# EAGLE design Main Board (EAGLE 9.6.2)
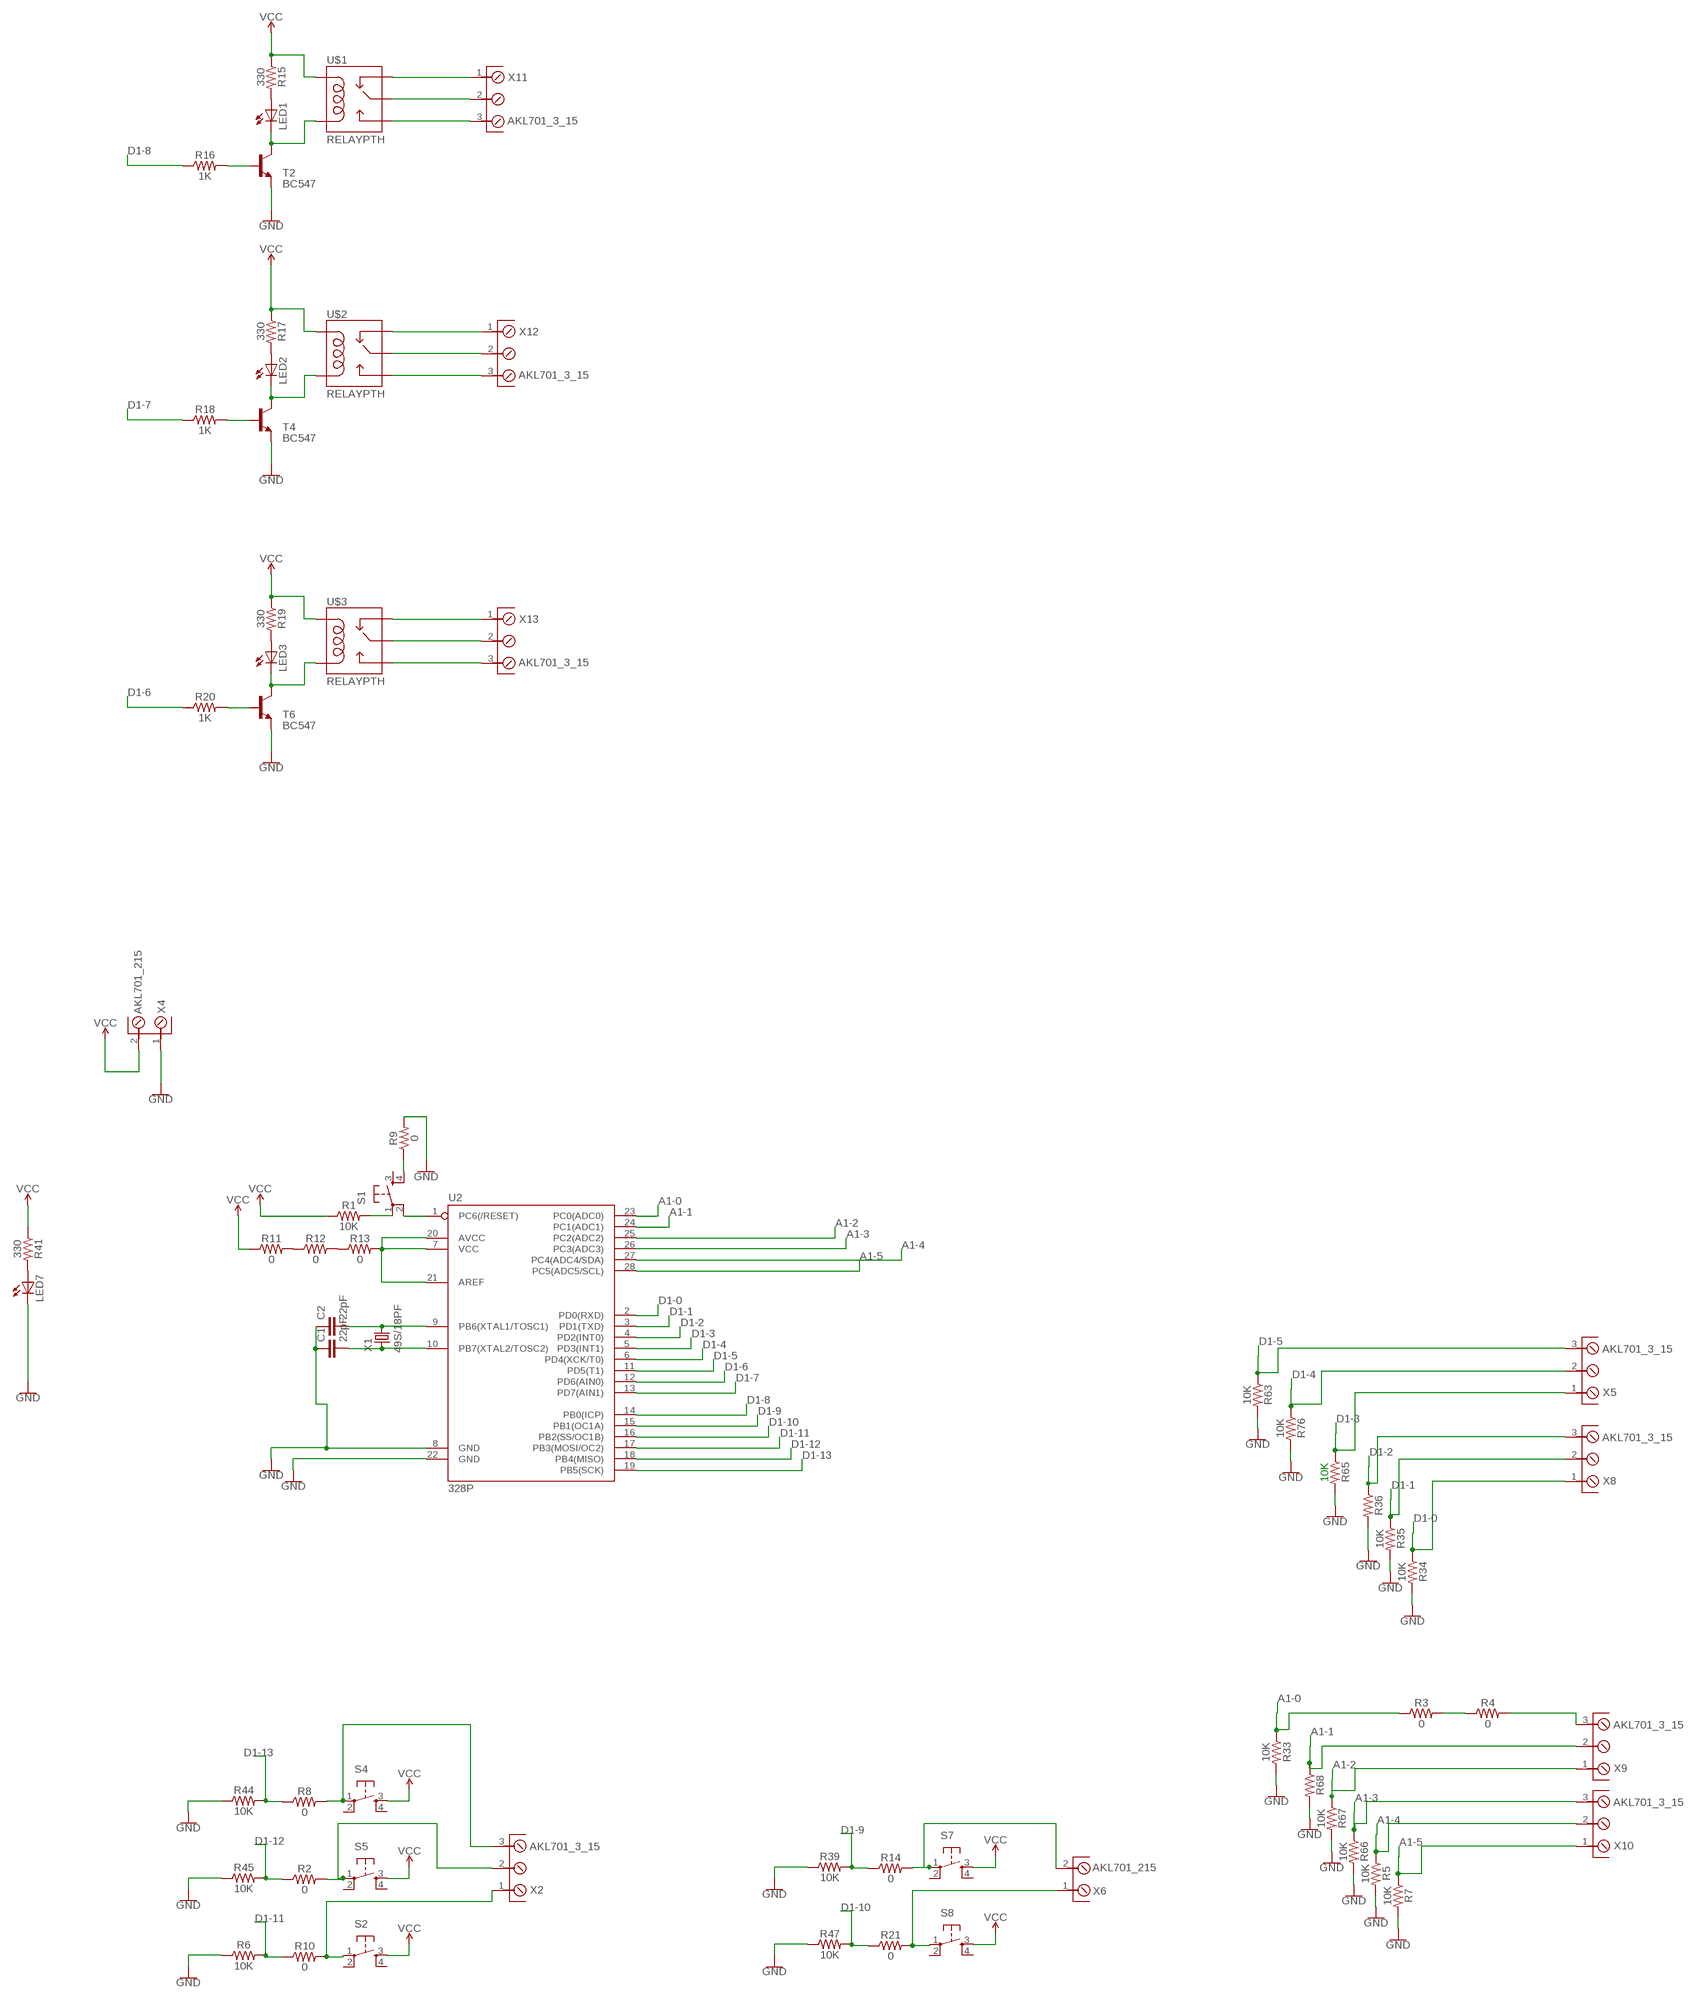
[diagram p0: schematic, sheet 1]

## Parts
C1  22pF  22PF-PTH-2.54MM-200V-5%  [CAP-PTH-2.54]
C2  22pF  22PF-PTH-2.54MM-200V-5%  [CAP-PTH-2.54]
LED1  LED5MM  [LED5MM]
LED2  LED5MM  [LED5MM]
LED3  LED5MM  [LED5MM]
LED7  LED5MM  [LED5MM]
R1  10K  10MOHM-HORIZ-1/4W-5%  [AXIAL-0.3]
R2  0  10MOHM-HORIZ-1/4W-5%  [AXIAL-0.3]
R3  0  10MOHM-HORIZ-1/4W-5%  [AXIAL-0.3]
R4  0  10MOHM-HORIZ-1/4W-5%  [AXIAL-0.3]
R5  10K  10MOHM-HORIZ-1/4W-5%  [AXIAL-0.3]
R6  10K  10MOHM-HORIZ-1/4W-5%  [AXIAL-0.3]
R7  10K  10MOHM-HORIZ-1/4W-5%  [AXIAL-0.3]
R8  0  10MOHM-HORIZ-1/4W-5%  [AXIAL-0.3]
R9  0  10MOHM-HORIZ-1/4W-5%  [AXIAL-0.3]
R10  0  10MOHM-HORIZ-1/4W-5%  [AXIAL-0.3]
R11  0  10MOHM-HORIZ-1/4W-5%  [AXIAL-0.3]
R12  0  10MOHM-HORIZ-1/4W-5%  [AXIAL-0.3]
R13  0  10MOHM-HORIZ-1/4W-5%  [AXIAL-0.3]
R14  0  10MOHM-HORIZ-1/4W-5%  [AXIAL-0.3]
R15  330  10MOHM-HORIZ-1/4W-5%  [AXIAL-0.3]
R16  1K  10MOHM-HORIZ-1/4W-5%  [AXIAL-0.3]
R17  330  10MOHM-HORIZ-1/4W-5%  [AXIAL-0.3]
R18  1K  10MOHM-HORIZ-1/4W-5%  [AXIAL-0.3]
R19  330  10MOHM-HORIZ-1/4W-5%  [AXIAL-0.3]
R20  1K  10MOHM-HORIZ-1/4W-5%  [AXIAL-0.3]
R21  0  10MOHM-HORIZ-1/4W-5%  [AXIAL-0.3]
R33  10K  10MOHM-HORIZ-1/4W-5%  [AXIAL-0.3]
R34  10K  10MOHM-HORIZ-1/4W-5%  [AXIAL-0.3]
R35  10K  10MOHM-HORIZ-1/4W-5%  [AXIAL-0.3]
R36  10K  10MOHM-HORIZ-1/4W-5%  [AXIAL-0.3]
R39  10K  10MOHM-HORIZ-1/4W-5%  [AXIAL-0.3]
R41  330  10MOHM-HORIZ-1/4W-5%  [AXIAL-0.3]
R44  10K  10MOHM-HORIZ-1/4W-5%  [AXIAL-0.3]
R45  10K  10MOHM-HORIZ-1/4W-5%  [AXIAL-0.3]
R47  10K  10MOHM-HORIZ-1/4W-5%  [AXIAL-0.3]
R63  10K  10MOHM-HORIZ-1/4W-5%  [AXIAL-0.3]
R65  10K  10MOHM-HORIZ-1/4W-5%  [AXIAL-0.3]
R66  10K  10MOHM-HORIZ-1/4W-5%  [AXIAL-0.3]
R67  10K  10MOHM-HORIZ-1/4W-5%  [AXIAL-0.3]
R68  10K  10MOHM-HORIZ-1/4W-5%  [AXIAL-0.3]
R76  10K  10MOHM-HORIZ-1/4W-5%  [AXIAL-0.3]
S1  TAC_SWITCHPTH  [TACTILE-PTH]
S2  TAC_SWITCHPTH  [TACTILE-PTH]
S4  TAC_SWITCHPTH  [TACTILE-PTH]
S5  TAC_SWITCHPTH  [TACTILE-PTH]
S7  TAC_SWITCHPTH  [TACTILE-PTH]
S8  TAC_SWITCHPTH  [TACTILE-PTH]
T2  BC547  [TO92]
T4  BC547  [TO92]
T6  BC547  [TO92]
U2  328P  ATMEGA328P_PDIP  [DIP28]
U$1  RELAYPTH  [SRD-05VDC-SL-C]
U$2  RELAYPTH  [SRD-05VDC-SL-C]
U$3  RELAYPTH  [SRD-05VDC-SL-C]
X1  49S/18PF  [XTAL_HC49]
X2  AKL701_3_15  [AKL701_3_15]
X4  AKL701_215  [AKL701_2_15]
X5  AKL701_3_15  [AKL701_3_15]
X6  AKL701_215  [AKL701_2_15]
X8  AKL701_3_15  [AKL701_3_15]
X9  AKL701_3_15  [AKL701_3_15]
X10  AKL701_3_15  [AKL701_3_15]
X11  AKL701_3_15  [AKL701_3_15]
X12  AKL701_3_15  [AKL701_3_15]
X13  AKL701_3_15  [AKL701_3_15]

## Nets
A1-0: R3.P$1 R33.P$1 U2.23(PC0(ADC0))
A1-1: R68.P$1 U2.24(PC1(ADC1)) X9.2
A1-2: R67.P$1 U2.25(PC2(ADC2)) X9.1
A1-3: R66.P$1 U2.26(PC3(ADC3)) X10.3
A1-4: R5.P$1 U2.27(PC4(ADC4/SDA)) X10.2
A1-5: R7.P$1 U2.28(PC5(ADC5/SCL)) X10.1
D1-0: R34.P$1 U2.2(PD0(RXD)) X8.1
D1-1: R35.P$1 U2.3(PD1(TXD)) X8.2
D1-2: R36.P$1 U2.4(PD2(INT0)) X8.3
D1-3: R65.P$1 U2.5(PD3(INT1)) X5.1
D1-4: R76.P$1 U2.6(PD4(XCK/T0)) X5.2
D1-5: R63.P$1 U2.11(PD5(T1)) X5.3
D1-6: R20.P$1 U2.12(PD6(AIN0))
D1-7: R18.P$1 U2.13(PD7(AIN1))
D1-8: R16.P$1 U2.14(PB0(ICP))
D1-9: R14.P$1 R39.P$2 U2.15(PB1(OC1A))
D1-10: R21.P$1 R47.P$2 U2.16(PB2(SS/OC1B))
D1-11: R6.P$2 R10.P$1 U2.17(PB3(MOSI/OC2))
D1-12: R2.P$1 R45.P$2 U2.18(PB4(MISO))
D1-13: R8.P$1 R44.P$2 U2.19(PB5(SCK))
GND: C1.1 C2.1 LED7.K(C) R5.P$2 R6.P$1 R7.P$2 R9.P$2 R33.P$2 R34.P$2 R35.P$2 R36.P$2 R39.P$1 R44.P$1 R45.P$1 R47.P$1 R63.P$2 R65.P$2 R66.P$2 R67.P$2 R68.P$2 R76.P$2 T2.1(E) T4.1(E) T6.1(E) U2.8(GND) U2.22(GND) X4.1
N$1: C2.2 U2.9(PB6(XTAL1/TOSC1)) X1.2
N$2: C1.2 U2.10(PB7(XTAL2/TOSC2)) X1.1
N$3: R1.P$2 S1.1
N$4: S1.2 U2.1(PC6(/RESET))
N$5: U$3.SWCLOSED(SWCLOSE) X13.1
N$6: U$3.SWCOMMON X13.2
N$7: U$3.SWOPEN X13.3
N$8: U$2.SWCLOSED(SWCLOSE) X12.1
N$9: LED1.A R15.P$2
N$10: LED1.K(C) T2.3(C) U$1.COIL0
N$11: R16.P$2 T2.2(B)
N$12: U$2.SWCOMMON X12.2
N$13: U$2.SWOPEN X12.3
N$14: U$1.SWCLOSED(SWCLOSE) X11.1
N$15: LED2.A R17.P$2
N$16: LED2.K(C) T4.3(C) U$2.COIL0
N$17: R18.P$2 T4.2(B)
N$18: U$1.SWCOMMON X11.2
N$19: U$1.SWOPEN X11.3
N$20: R10.P$2 S2.1 X2.1
N$21: LED3.A R19.P$2
N$22: LED3.K(C) T6.3(C) U$3.COIL0
N$23: R20.P$2 T6.2(B)
N$24: R2.P$2 S5.1 X2.2
N$25: R4.P$2 X9.3
N$26: R3.P$2 R4.P$1
N$27: R8.P$2 S4.1 X2.3
N$28: R14.P$2 S7.1 X6.2
N$29: R21.P$2 S8.1 X6.1
N$46: LED7.A R41.P$2
N$55: R9.P$1 S1.4
N$58: R13.P$2 U2.7(VCC) U2.20(AVCC) U2.21(AREF)
N$59: R11.P$2 R12.P$1
N$60: R12.P$2 R13.P$1
VCC: R1.P$1 R11.P$1 R15.P$1 R17.P$1 R19.P$1 R41.P$1 S2.3 S4.3 S5.3 S7.3 S8.3 U$1.COIL1 U$2.COIL1 U$3.COIL1 X4.2
Unconnected: S1.3 S2.2 S2.4 S4.2 S4.4 S5.2 S5.4 S7.2 S7.4 S8.2 S8.4

## Library data of the parts
C1 C2 = SparkFun-Capacitors:22PF: 22pF ceramic capacitors A capacitor is a passive two-terminal electrical component used to store electrical energy temporarily in an electric field.; PROD_ID: CAP-09128
LED1-LED3 LED7 = adafruit:LED: LED OSRAM: - CHIPLED LG R971, LG N971, LY N971, LG Q971, LY Q971, LO R971, LY R971 LH N974, LH R974 LS Q976, LO Q976, LY Q976 LO Q996 - Hyper CHIPLED LW Q18S LB Q993, LB Q99A, LB R99A - SideLED LS A670, LO A670, LY A670, LG A670, LP A670 LB A673, LV A673, LT A673, LW A673 LH A674 LY A675 LS A676, LA A676, LO A676, LY A676, LW A676 LS A679, LY A679, LG A679 - Hyper Micro SIDELED® LS Y876, LA Y876, LO Y876, LY Y876 LT Y87S - SmartLED LW L88C, LW L88S LB L89C, LB L89S, LG L890 LS L89K, LO L89K, LY L89K LS L896, LA L896, LO L896, LY L896 - TOPLED LS T670, LO T670, LY T670, LG T670, LP T670 LSG T670, LSP T670, LSY T670, LOP T670, LYG T670 LG T671, LOG T671, LSG T671 LB T673, LV T673, LT T673, LW T673 LH T674 LS T676, LA T676, LO T676, LY T676, LB T676, LH T676, LSB T676, LW T676 LB T67C, LV T67C, LT T67C, LS T67K, LO T67K, LY T67K, LW E67C LS E67B, LA E67B, LO E67B, LY E67B, LB E67C, LV E67C, LT E67C LW T67C LS T679, LY T679, LG T679 LS T770, LO T770, LY T770, LG T770, LP T770 LB T773, LV T773, LT T773, LW T773 LH T774 LS E675, LA E675, LY E675, LS T675 LS T776, LA T776, LO T776, LY T776, LB T776 LHGB T686 LT T68C, LB T68C - Hyper Mini TOPLED® LB M676 - Mini TOPLED Santana® LG M470 LS M47K, LO M47K, LY M47K Source: http://www.osram.convergy.de/
R1-R21 R33-R36 R39 R41 R44 R45 R47 R63 R65-R68 R76 = SparkFun-Resistors:10MOHM: RES-09327; PROD_ID: RES-09327; VALUE: 10M
S1 S2 S4 S5 S7 S8 = SparkFun:TAC_SWITCH: Momentary Switch Button commonly used for reset or general input. Spark Fun Electronics SKU : COM-00097
T2 T4 T6 = transistor:BC547: NPN TRANSISTOR
U2 = SparkFun-IC-Microcontroller:ATMEGA328P_PDIP: Atmel 328P Through hole ATMEGA328P uC used in the Arduino 32kb flash, 1k EEPROM, 2k SRAM Datasheet <http://www.sparkfun.com/datasheets/Components/SMD/ATMega328.pdf> SparkFun Products Storefront component: AVR 28 Pin 20MHz 32K 6A/D - ATMega328P <https://www.sparkfun.com/products/9061> (COM-09061) SparkFun Simon Says - Through-Hole Soldering Kit <https://www.sparkfun.com/products/10547> (KIT-10547) SparkFun Learn to Solder - Simon Says <https://www.sparkfun.com/products/13708> (KIT-13708) SparkFun BigTime Watch Kit <https://www.sparkfun.com/products/11734> (KIT-11734) SparkFun ClockIt <https://www.sparkfun.com/products/10930> (KIT-10930) SparkFun Serial Enabled LCD Kit <https://www.sparkfun.com/products/10097> (LCD-10097) SparkFun Simon Tilts - Through Hole Soldering Kit <https://www.sparkfun.com/products/12634> (KIT-12634) SparkFun Frequency Counter Kit <https://www.sparkfun.com/products/10140> (KIT-10140) FabFM Radio Kit <https://www.sparkfun.com/products/11043> (KIT-11043) SparkFun Binary Blaster Kit <https://www.sparkfun.com/products/12037> (KIT-12037) SparkFun Metro-Gnome <https://www.sparkfun.com/products/9236> (KIT-09236) ATmega328 with Arduino Optiboot (Uno) <https://www.sparkfun.com/products/10524> (DEV-10524); PROD_ID: IC-09136
U$1-U$3 = SRD-05VDC-SL-C:RELAY: SPDT relay (COM-00101)
X1 = Crystals_Oscillators:49S/18PF: Crystal Manufacturer's datasheet <https://datasheet.octopart.com/49S-18PF-Xinhunjing-datasheet-30677139.pdf>; CREATED_BY: PCBLayout.com; MANUFACTURER: Xinhunjing; MPN: 49S/18PF; PACKAGE: SMD
X2 X5 X8-X13 = _con_riacon_akl701:AKL701_3*: RIACON (Ria Connect) Screw Type Terminal Block Type AKL 701 - 3 (pole-size: 3) centerline 6.35 mm / 0.250 inches, 400 V / 24 A, horizontal wire entry, lift system, modular packages: _13: recommended pcb hole dia. = 1,3 mm _15: pcb hole dia. = 1,5 mm (prototyping) Auhtor: Dipl.-Ing. FH Rainer Bayer, Hochschule Heilbronn (rainer.bayer@hs-heilbronn.de)
X4 X6 = _con_riacon_akl701:AKL701_2*: RIACON (Ria Connect) Screw Type Terminal Block Type AKL 701 - 2 (pole-size: 2) centerline 6.35 mm / 0.250 inches, 400 V / 24 A, horizontal wire entry, lift system, modular packages: _13: recommended pcb hole dia. = 1,3 mm _15: pcb hole dia. = 1,5 mm (prototyping) Auhtor: Dipl.-Ing. FH Rainer Bayer, Hochschule Heilbronn (rainer.bayer@hs-heilbronn.de)

## Board
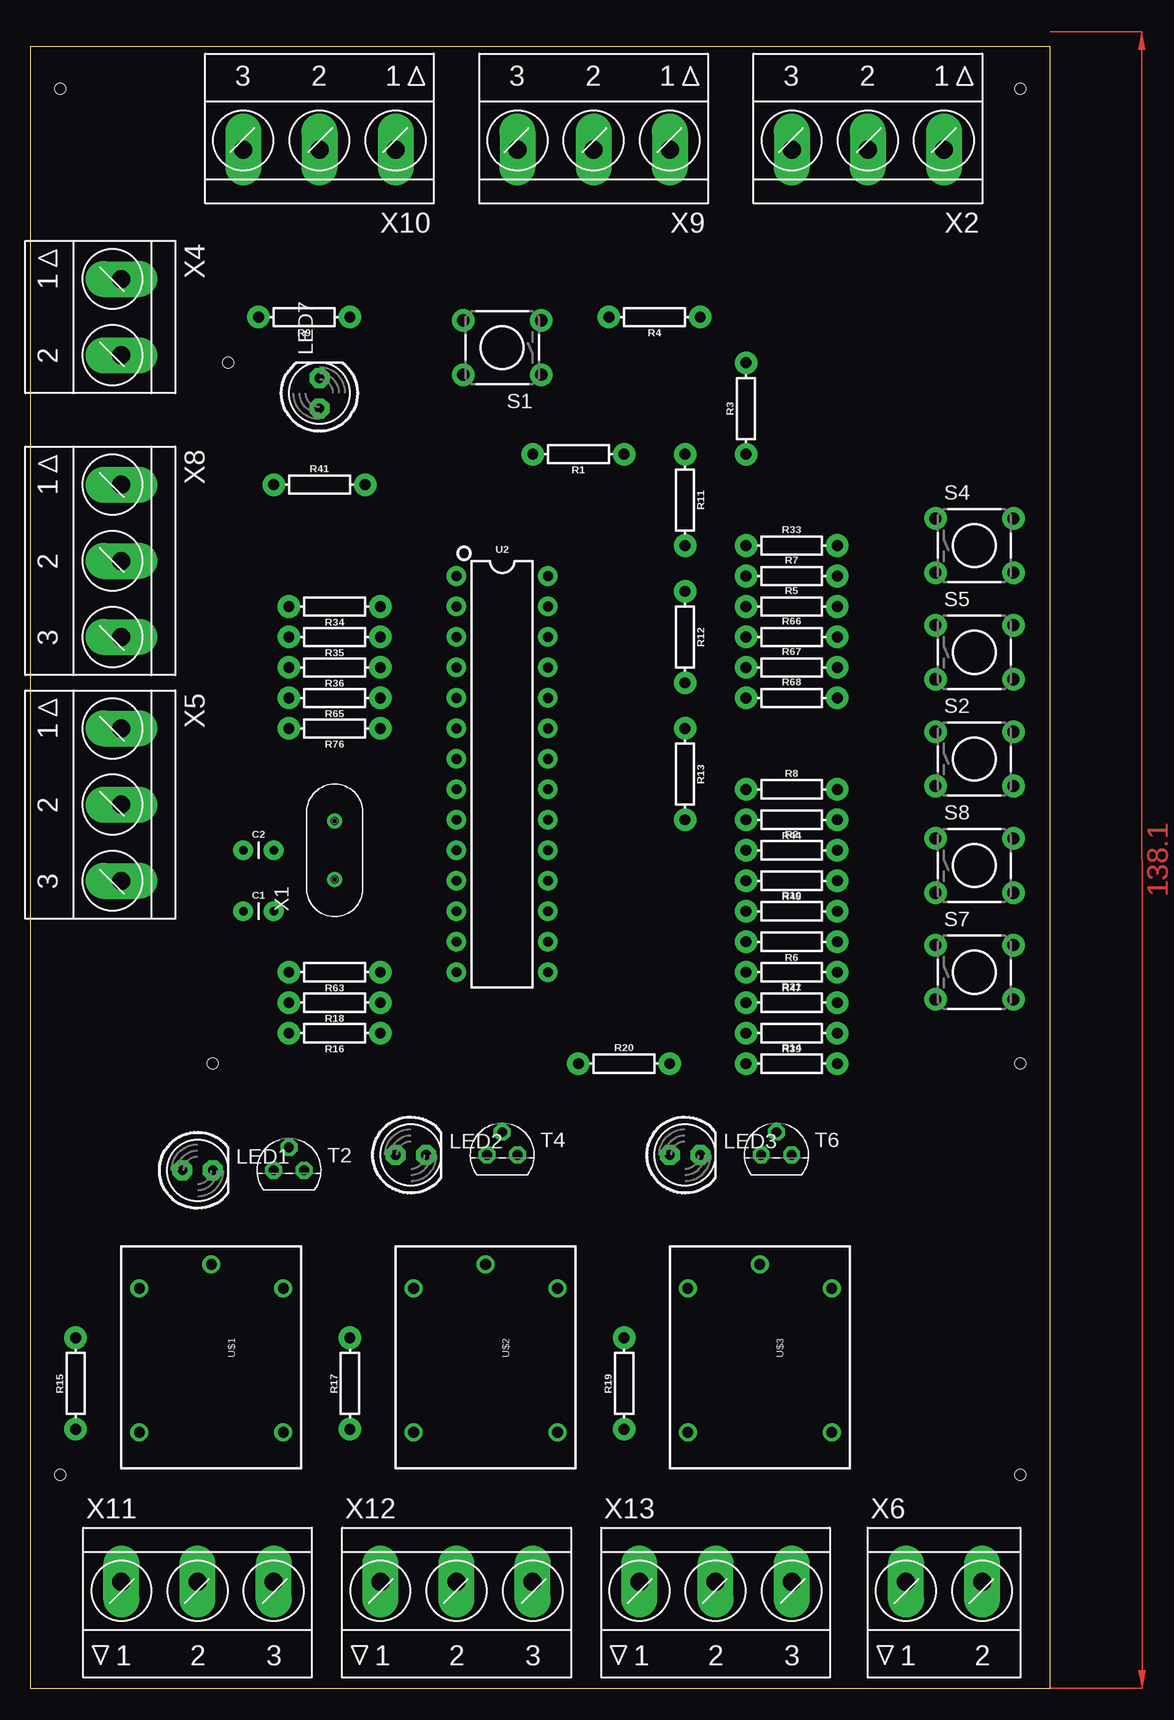
[diagram p1: board, top side]
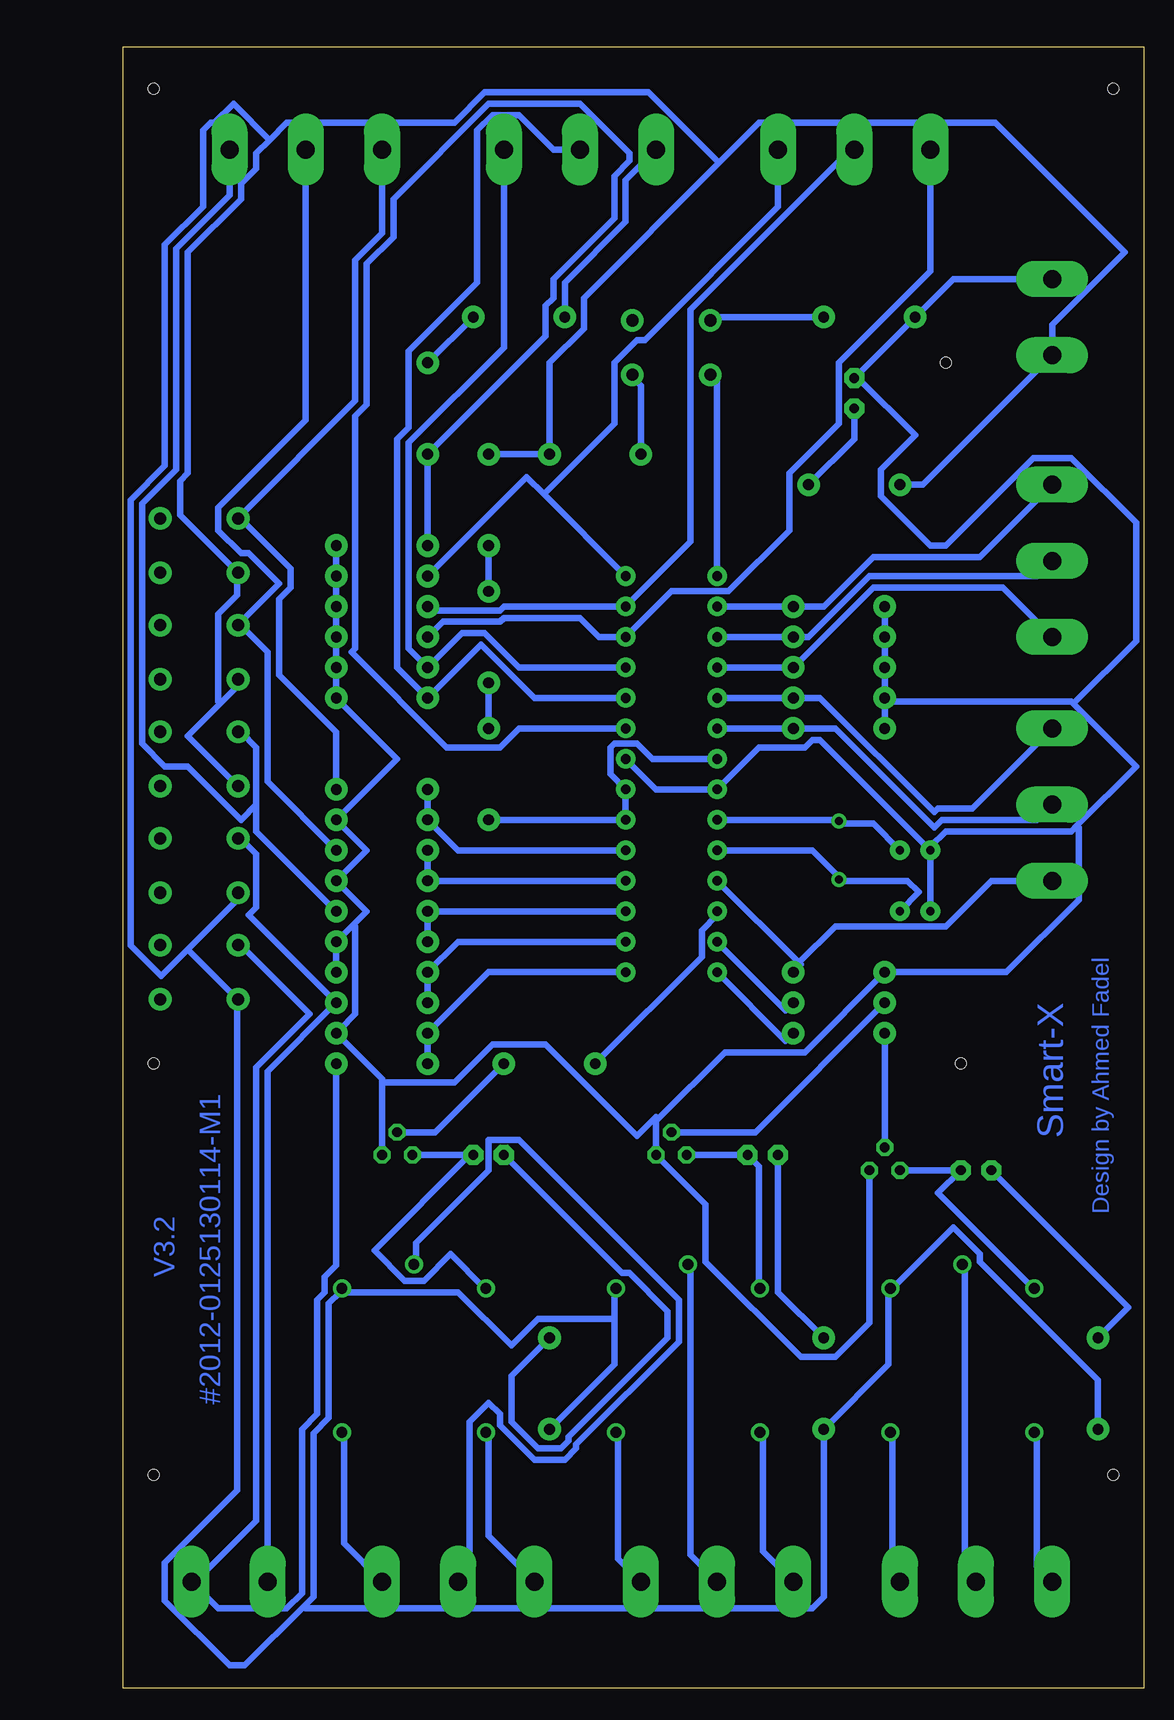
[diagram p2: board, bottom side, seen from below]

Size 85.07 x 136.83 mm. Coordinates in mm from the lower left corner, seen from the top.
Outline: 0,0 85.07,0 85.07,136.83 0,136.83 0,0
Copper layers 16: Bottom 0.035mm
Design rules "eC_1Layer_PClass6_BaseCopperO35_eCDefault *": minimum track width 0.53mm, minimum drill 0.35mm, track to track 0.15mm, track to pad 0.15mm, pad to pad 0.15mm, via to via 0.15mm, smd to smd 0mil, copper to edge 0.25mm, drill to drill 0.35mm, minimum pad ring 0.3mm, minimum via ring 0.3mm, stop-mask expansion 0mil, vias tented up to drill 0.45mm, thermal gap 0.2mm
Holes 0.9 mm at 2.54,133.35 82.55,133.35 82.55,52.07 15.24,52.07 2.54,17.78 82.55,17.78 16.51,110.49

### Footprints (pad centres in the part's own frame; a part is rotated, then mirrored left to right if it is on the bottom)
CAP-PTH-2.54 = drill 0.7 pad 1.651: 1 -1.27,0; 2 1.27,0
LED5MM = drill 0.813 pad 1.676 octagon: A -1.27,0; K 1.27,0
AXIAL-0.3 = drill 0.9 pad 1.88: P$1 -3.81,0; P$2 3.81,0
TACTILE-PTH = drill 1.016 pad 1.88: 1 -3.251,2.261; 2 3.251,2.261; 3 -3.251,-2.261; 4 3.251,-2.261
TO92 = drill 0.813 octagon: 1 1.27,0; 2 0,1.905; 3 -1.27,0
DIP28 = drill 0.813 pad 1.626: 1 -16.51,-3.81; 2 -13.97,-3.81; 3 -11.43,-3.81; 4 -8.89,-3.81; 5 -6.35,-3.81; 6 -3.81,-3.81; 7 -1.27,-3.81; 8 1.27,-3.81; 9 3.81,-3.81; 10 6.35,-3.81; 11 8.89,-3.81; 12 11.43,-3.81; 13 13.97,-3.81; 14 16.51,-3.81; 15 16.51,3.81; 16 13.97,3.81; 17 11.43,3.81; 18 8.89,3.81; 19 6.35,3.81; 20 3.81,3.81; 21 1.27,3.81; 22 -1.27,3.81; 23 -3.81,3.81; 24 -6.35,3.81; 25 -8.89,3.81; 26 -11.43,3.81; 27 -13.97,3.81; 28 -16.51,3.81
SRD-05VDC-SL-C = drill 0.9: COIL0 -5.39,-6.12; COIL1 -5.39,5.88; SWCLOSED 6.61,-6.12; SWCOMMON -7.39,-0.12; SWOPEN 6.61,5.88
XTAL_HC49 = drill 0.65 pad 1.05: 1 -2.44,0; 2 2.44,0
AKL701_3_15 = drill 1.5 pad 3 long: 1 -6.35,0; 2 0,0; 3 6.35,0
AKL701_2_15 = drill 1.5 pad 3 long: 1 -3.175,0; 2 3.175,0

### Placement (x,y rotation side)
C1  19.05,64.77 0 top
C2  19.05,69.85 0 top
LED1  13.97,43.18 0 top
LED2  31.75,44.45 0 top
LED3  54.61,44.45 0 top
LED7  24.13,107.95 90 top
R1  45.72,102.87 180 top
R2  63.5,69.85 0 top
R3  59.69,106.68 90 top
R4  52.07,114.3 180 top
R5  63.5,90.17 0 top
R6  63.5,62.23 180 top
R7  63.5,92.71 0 top
R8  63.5,74.93 0 top
R9  22.86,114.3 180 top
R10  63.5,64.77 0 top
R11  54.61,99.06 270 top
R12  54.61,87.63 270 top
R13  54.61,76.2 270 top
R14  63.5,52.07 0 top
R15  3.81,25.4 90 top
R16  25.4,54.61 180 top
R17  26.67,25.4 90 top
R18  25.4,57.15 180 top
R19  49.53,25.4 90 top
R20  49.53,52.07 0 top
R21  63.5,57.15 0 top
R33  63.5,95.25 0 top
R34  25.4,90.17 180 top
R35  25.4,87.63 180 top
R36  25.4,85.09 180 top
R39  63.5,54.61 180 top
R41  24.13,100.33 0 top
R44  63.5,72.39 180 top
R45  63.5,67.31 180 top
R47  63.5,59.69 180 top
R63  25.4,59.69 180 top
R65  25.4,82.55 180 top
R66  63.5,87.63 0 top
R67  63.5,85.09 0 top
R68  63.5,82.55 0 top
R76  25.4,80.01 180 top
S1  39.37,111.76 180 top
S2  78.74,77.47 0 top
S4  78.74,95.25 0 top
S5  78.74,86.36 0 top
S7  78.74,59.69 0 top
S8  78.74,68.58 0 top
T2  21.59,43.18 0 top
T4  39.37,44.45 0 top
T6  62.23,44.45 0 top
U2  39.37,76.2 270 top
U$1  15.24,27.94 270 top
U$2  38.1,27.94 270 top
U$3  60.96,27.94 270 top
X1  25.4,69.85 90 top
X2  69.85,128.27 180 top
X4  7.62,114.3 270 top
X5  7.62,73.66 270 top
X6  76.2,8.89 0 top
X8  7.62,93.98 270 top
X9  46.99,128.27 180 top
X10  24.13,128.27 180 top
X11  13.97,8.89 0 top
X12  35.56,8.89 0 top
X13  57.15,8.89 0 top

### Tracks (layer width: path | path; a pad name or v marks a point on that pad's centre or on a via)
A1-0
  Bottom 0.53: U2.23 52.07,80.01 53.66,78.42 58.1,78.42 66.04,86.36 65.72,86.68 65.72,106.05 64.77,107 64.77,118.75 62.55,120.97 62.55,124.14 54.61,132.08 46.99,132.08 42.86,127.95 42.86,127.32 44.13,126.05 44.13,122.55 49.21,117.47 49.21,115.89 49.85,115.25 49.85,112.71 R3.P$1 R33.P$1
A1-1
  Bottom 0.53: U2.24 50.8,82.55 55.25,87 R68.P$1 62.23,85.09 62.23,104.14 61.28,105.09 61.28,111.44 55.56,117.16 55.56,129.86 54.29,131.13 52.07,131.13 49.21,128.27 X9.2
A1-2
  Bottom 0.53: U2.25 52.07,85.09 54.93,87.95 56.83,87.95 R67.P$1 61.28,86.68 61.28,103.82 53.34,111.76 X9.1
A1-3
  Bottom 0.53: R66.P$1 58.42,88.9 53.66,88.9 53.34,89.22 46.99,89.22 45.4,87.63 U2.26 39.37,91.44 34.61,91.44 29.53,96.52 29.53,101.28 25.4,105.41 25.4,110.49 17.78,118.11 X10.3
A1-4
  Bottom 0.53: R5.P$1 59.37,89.85 53.66,89.85 53.34,90.17 U2.27 37.78,95.57 37.78,114.94 24.45,128.27 X10.2
A1-5
  Bottom 0.53: 50.01,99.54 51.44,100.97 R7.P$1 | 50.01,99.54 U2.28 | X10.1 30.48,123.51 41.59,112.39 42.23,112.39 44.13,110.49 44.13,105.41 50.01,99.54
D1-0
  Bottom 0.53: U2.2 R34.P$1 26.67,90.17 22.54,94.3 13.65,94.3 X8.1
D1-1
  Bottom 0.53: U2.3 R35.P$1 27.94,87.63 22.86,92.71 8.89,92.71 X8.2
D1-2
  Bottom 0.53: U2.4 R36.P$1 22.54,91.76 11.75,91.76 X8.3
D1-3
  Bottom 0.53: U2.5 R65.P$1 26.99,82.55 17.46,73.03 17.14,73.34 14.29,73.34 X5.1
D1-4
  Bottom 0.53: U2.6 R76.P$1 25.72,80.01 17.46,71.75 16.83,72.39 8.89,72.39 X5.2
D1-5
  Bottom 0.53: 28.73,60.48 28.58,60.33 R63.P$1 | 28.73,60.48 U2.11 | X5.3 12.7,67.31 16.51,63.5 25.72,63.5 28.73,60.48
D1-6
  Bottom 0.53: U2.12 35.56,64.45 36.83,63.18 36.83,60.96 R20.P$1
D1-7
  Bottom 0.53: U2.13 29.84,56.52 R18.P$1
D1-8
  Bottom 0.53: U2.14 29.84,53.97 R16.P$1
D1-9
  Bottom 0.53: U2.15 54.61,59.69 R39.P$2 R14.P$1
D1-10
  Bottom 0.53: U2.16 57.15,62.23 R47.P$2 R21.P$1
D1-11
  Bottom 0.53: U2.17 R10.P$1 R6.P$2
D1-12
  Bottom 0.53: U2.18 R45.P$2 R2.P$1
D1-13
  Bottom 0.53: U2.19 57.15,69.85 R44.P$2 R8.P$1
GND
  Bottom 0.53: R33.P$2 R7.P$2 R5.P$2 R66.P$2 R67.P$2 R68.P$2 62.23,77.47 R44.P$1 64.77,69.85 R45.P$1 64.77,64.77 65.88,63.66 | 63.5,50.48 63.5,50.8 R39.P$1 66.99,54.61 66.99,54.93 65.72,56.2 65.72,63.5 65.88,63.66 | 63.5,50.48 T6.1 | R47.P$1 R6.P$1 65.88,63.66 | T2.1 22.86,30.48 25.72,27.62 28.58,27.62 36.51,35.56 36.51,40.32 T4.1 40.64,47.31 40.48,47.47 | 40.48,47.47 34.92,53.02 28.26,53.02 R63.P$2 11.43,59.69 5.4,65.72 5.4,71.75 5.56,71.91 | X4.1 15.88,117.47 R9.P$2 LED7.K 23.81,109.22 19.05,104.46 21.91,101.6 21.91,99.38 17.78,95.25 16.51,95.25 9.21,102.55 6.03,102.55 0.63,97.16 0.63,87.31 5.87,82.07 | 21.59,82.23 R76.P$2 | R34.P$2 R35.P$2 R36.P$2 R65.P$2 21.59,82.23 | C2.1 C1.1 | U2.22 40.64,74.93 U2.8 32.07,78.42 28.26,78.42 27.62,79.06 26.99,79.06 C2.1 | 21.59,82.23 6.03,82.23 5.87,82.07 | 5.87,82.07 0.63,76.84 5.56,71.91 | 5.56,71.91 6.03,71.44 16.51,71.44 17.78,70.17 C2.1 | 63.5,50.48 57.47,50.48 54.29,53.66 49.85,53.66 42.23,46.04 40.64,47.62 40.48,47.47
N$1
  Bottom 0.53: C2.2 22.54,72.07 25.4,72.07 X1.2 25.4,72.39 U2.9
N$2
  Bottom 0.53: C1.2 18.73,66.36 19.68,67.31 25.4,67.31 X1.1 25.4,67.63 27.62,69.85 U2.10
N$3
  Bottom 0.53: R1.P$2 41.91,108.58 42.55,109.22 S1.1
N$4
  Bottom 0.53: U2.1 35.56,108.9 35.88,109.22 S1.2
N$5
  Bottom 0.53: X13.1 54.61,12.7 54.61,21.27 U$3.SWCLOSED
N$6
  Bottom 0.53: X13.2 56.2,9.84 56.2,22.22 54.61,23.81 53.66,22.86 53.66,21.91 50.8,19.05 48.26,19.05 47.31,20 47.31,20.32 38.73,28.89 38.73,32.38 52.07,45.72 54.61,45.72 54.61,43.18 60.64,37.15 60.64,35.56 U$3.SWCOMMON
N$7
  Bottom 0.53: X13.3 66.67,12.06 66.67,21.27 U$3.SWOPEN
N$8
  Bottom 0.53: X12.1 31.75,11.43 31.75,21.27 U$2.SWCLOSED
N$9
  Bottom 0.53: LED1.A 1.27,31.75 R15.P$2
N$10
  Bottom 0.53: T2.3 LED1.K 17.14,41.27 9.21,33.34 U$1.COIL0
N$11
  Bottom 0.53: R16.P$2 T2.2
N$12
  Bottom 0.53: X12.2 37.78,11.11 37.78,35.24 U$2.SWCOMMON
N$13
  Bottom 0.53: X12.3 43.81,10.79 43.81,21.27 U$2.SWOPEN
N$14
  Bottom 0.53: X11.1 8.89,10.16 8.89,21.27 U$1.SWCLOSED
N$15
  Bottom 0.53: LED2.A 30.48,33.02 R17.P$2
N$16
  Bottom 0.53: T4.3 LED2.K 32.07,43.5 32.07,33.34 U$2.COIL0
N$17
  Bottom 0.53: T4.2 32.38,46.35 R18.P$2
N$18
  Bottom 0.53: X11.2 14.92,9.84 14.92,35.24 U$1.SWCOMMON
N$19
  Bottom 0.53: X11.3 20.95,9.52 20.95,21.27 U$1.SWOPEN
N$20
  Bottom 0.53: R10.P$2 73.98,71.44 73.98,73.66 | 73.98,73.66 73.98,78.42 75.25,79.69 S2.1 | X2.1 76.2,124.46 80.64,120.02 80.64,101.6 83.5,98.74 83.5,78.74 81.6,76.84 79.69,76.84 75.25,72.39 73.98,73.66
N$21
  Bottom 0.53: LED3.A 43.5,34.61 42.86,34.61 39.69,31.43 39.69,29.21 47.94,20.95 47.94,20.64 48.58,20 50.48,20 52.7,22.22 52.7,26.03 R19.P$2
N$22
  Bottom 0.53: 56.2,44.45 T6.3 | 56.2,44.45 64.14,36.51 61.59,33.97 60.01,33.97 57.78,36.2 54.93,33.34 U$3.COIL0 | 56.2,44.45 LED3.K
N$23
  Bottom 0.53: T6.2 59.05,46.35 R20.P$2
N$24
  Bottom 0.53: R2.P$2 73.03,75.56 73.03,86.36 75.25,88.58 S5.1 75.25,88.9 72.07,92.07 74.61,94.61 75.25,94.61 77.15,96.52 77.15,98.42 69.85,105.73 X2.2
N$25
  Bottom 0.53: R4.P$2 48.26,117.16 43.18,122.24 43.18,125.73 X9.3
N$26
  Bottom 0.53: R3.P$2 R4.P$1
N$27
  Bottom 0.53: R8.P$2 67.31,79.69 72.07,84.45 72.07,90.81 71.12,91.76 71.12,93.34 75.25,97.47 S4.1 75.25,97.79 65.72,107.31 65.72,119.06 63.5,121.28 X2.3
N$28
  Bottom 0.53: R14.P$2 67.31,35.24 68.26,34.29 68.26,33.02 68.9,32.38 68.9,22.86 70.17,21.59 70.17,7.94 71.44,6.67 77.15,6.67 X6.2 79.06,8.89 73.98,13.97 73.98,51.75 69.53,56.2 75.25,61.91 S7.1
N$29
  Bottom 0.53: S8.1 75.25,70.8 73.98,69.53 73.98,65.09 74.61,64.45 R21.P$2 73.03,51.44 X6.1
N$46
  Bottom 0.53: LED7.A 24.13,104.14 R41.P$2
N$55
  Bottom 0.53: R9.P$1 35.88,114.3 S1.4
N$58
  Bottom 0.53: U2.7 40.96,77.47 42.23,78.74 44.13,78.74 44.45,78.42 44.45,76.2 U2.21 U2.20 R13.P$2
N$59
  Bottom 0.53: R11.P$2 R12.P$1
N$60
  Bottom 0.53: R12.P$2 R13.P$1
VCC
  Bottom 0.53: 76.99,82.07 75.25,83.82 S5.3 | 76.99,82.07 79.69,79.38 75.56,75.25 S2.3 | 76.99,82.07 77.15,82.23 77.15,89.53 75.56,91.12 75.56,92.71 S4.3 75.56,93.03 80.33,97.79 80.33,100.65 79.69,101.28 79.69,119.7 75.25,124.14 75.25,125.41 73.98,126.68 73.98,127.95 72.87,129.06 | R11.P$1 R1.P$1 49.53,110.49 46.67,113.35 46.67,115.89 35.4,127.16 | R41.P$1 18.41,100.33 X4.2 7.62,113.66 1.59,119.7 12.38,130.49 32.07,130.49 35.4,127.16 | 72.87,129.06 71.44,130.49 57.47,130.49 54.93,133.03 41.27,133.03 35.4,127.16 | R15.P$1 3.81,25.72 13.65,35.56 13.65,36.2 15.88,38.42 20.95,33.34 U$1.COIL1 21.27,33.02 21.27,26.99 R17.P$1 26.67,7.62 27.62,6.67 69.85,6.67 70.01,6.83 | 79.69,61.59 75.56,57.47 S7.3 75.56,57.15 75.56,16.51 81.6,10.48 81.6,7.3 76.2,1.91 74.93,1.91 70.01,6.83 | 79.69,61.59 75.25,66.04 S8.3 | 44.13,30.8 44.13,26.99 R19.P$1 | 44.13,30.8 44.13,33.02 U$2.COIL1 | 44.13,30.8 50.48,30.8 52.7,28.57 57.15,33.02 66.67,33.02 U$3.COIL1 66.99,33.02 67.94,32.07 67.94,22.54 69.22,21.27 69.22,7.62 70.01,6.83 | 72.87,129.06 75.88,132.08 77.47,130.49 77.79,130.49 78.42,129.86 78.42,123.51 81.6,120.33 81.6,101.92 84.45,99.06 84.45,61.91 81.92,59.37 79.69,61.59
(copper drawn outside any net)
  shapes: Top area x1

### Text on the board
Bottom: Design by Ahmed Fadel | Smart-X | #2012-0125130114-M1 | V3.2